# EAGLE schematic DRV5032_Hall_0402 (EAGLE 7.5.0)
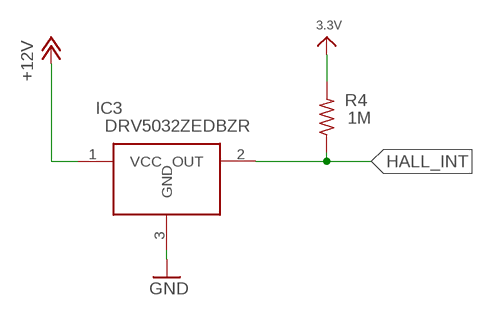
[diagram p0: schematic, sheet 1]

## Parts
IC3  DRV5032ZEDBZR  [SOT95P237X112-3N]
R4  1M  R-US_R0402  [R0402]

## Nets
3.3V: R4.2
+12V: IC3.1(VCC)
GND: IC3.3(GND)
HALL_INT: IC3.2(OUT) R4.1

## Library data of the parts
IC3 = SamacSys_Parts:DRV5032ZEDBZR: Ultra-Low Power 1.65V to 5.5V Hall Effect Switch Sensor Source: Datasheet <http://www.ti.com/lit/gpn/drv5032>; DESCRIPTION: Ultra-Low Power 1.65V to 5.5V Hall Effect Switch Sensor; HEIGHT: 1.12mm; MANUFACTURER_NAME: Texas Instruments; MANUFACTURER_PART_NUMBER: DRV5032ZEDBZR; MOUSER_PART_NUMBER: 595-DRV5032ZEDBZR; MOUSER_PRICE-STOCK: https://www.mouser.co.uk/ProductDetail/Texas-Instruments/DRV5032ZEDBZR?qs=BZBei1rCqCAHXJJFMj1gIw%3D%3D
R4 = rcl@1:R-US_: RESISTOR, American symbol; SPICEPREFIX: R